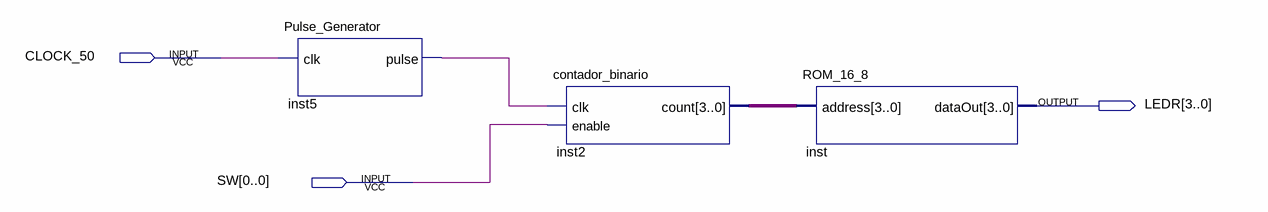
[diagram p0: schematic sheet]
// Quartus schematic ROM_Demo.bdf as structural Verilog: 3 symbols, 3 pins
module ROM_Demo (
  input  CLOCK_50,
  input  [0:0] SW,
  output [3:0] LEDR
);

  wire inst5_pulse;
  wire [3:0] inst2_count;

  Pulse_Generator inst5 (.clk(CLOCK_50), .pulse(inst5_pulse));
  contador_binario inst2 (.clk(inst5_pulse), .enable(SW[0]), .count(inst2_count));
  ROM_16_8 inst (.address(inst2_count), .dataOut(LEDR));
endmodule
